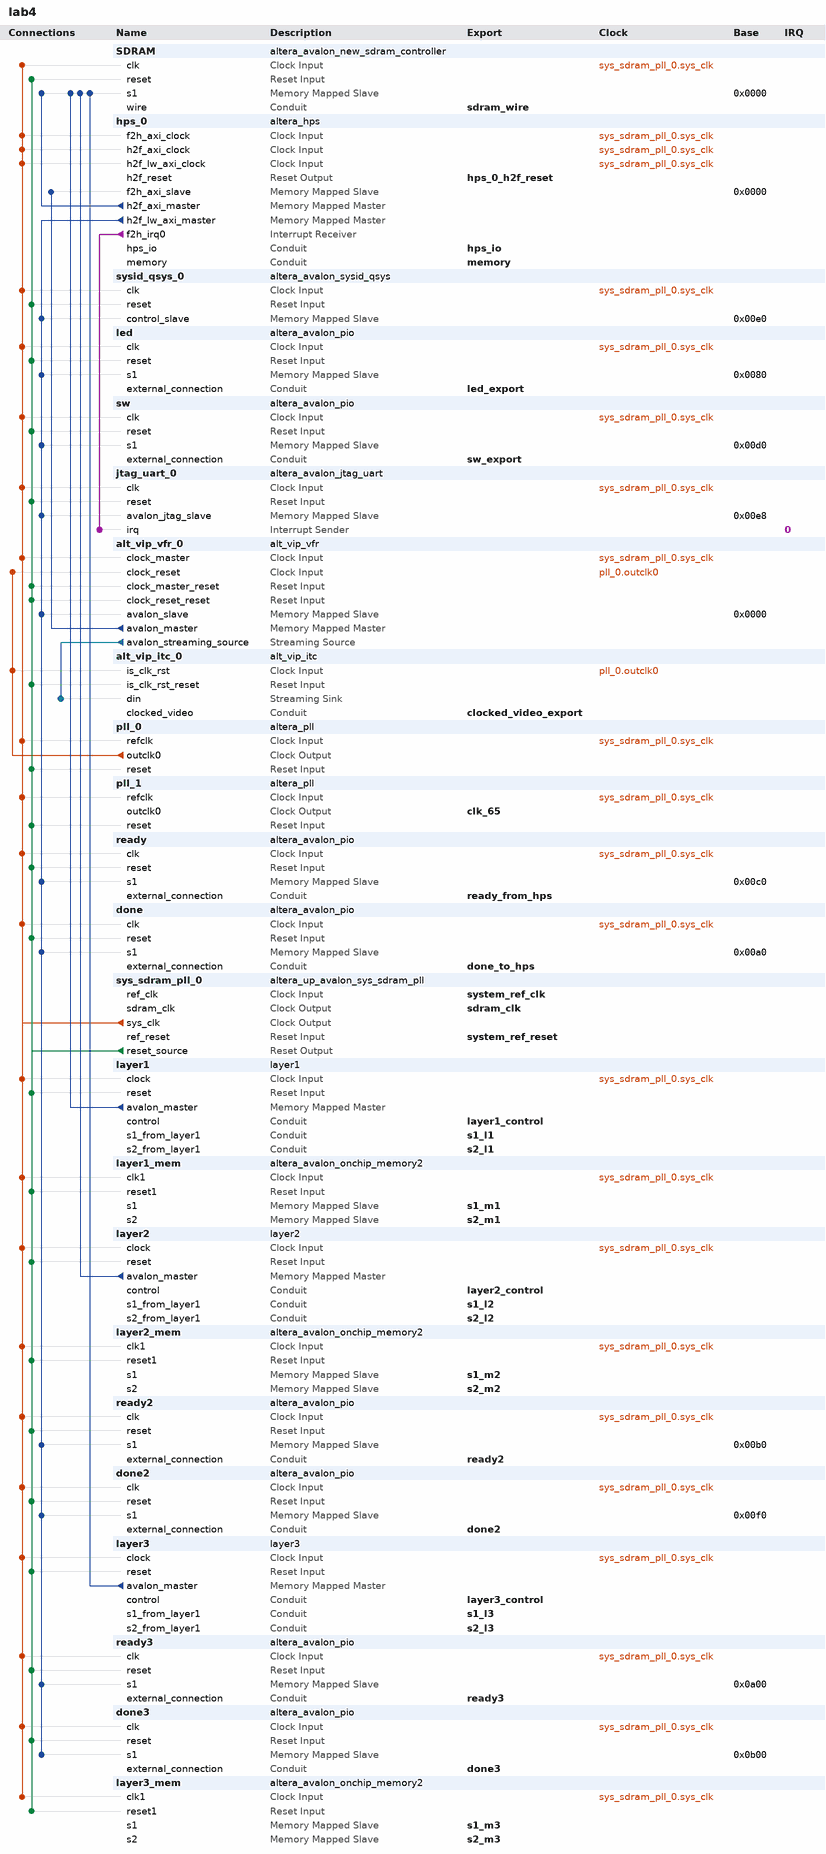
[diagram p0: system contents]
# Platform Designer (Qsys) system lab4, Cyclone V 5CSEMA5F31C6
# Parameters at their usual value, and those the tool derives, are not listed.
package require -exact qsys 15.0
create_system lab4
set_project_property DEVICE_FAMILY {Cyclone V}
set_project_property DEVICE 5CSEMA5F31C6

add_instance SDRAM altera_avalon_new_sdram_controller 15.0
set_instance_parameter_value SDRAM TAC 5.5
set_instance_parameter_value SDRAM TRCD 20.0
set_instance_parameter_value SDRAM TRP 20.0
set_instance_parameter_value SDRAM casLatency 3
set_instance_parameter_value SDRAM columnWidth 10
set_instance_parameter_value SDRAM dataWidth 16
set_instance_parameter_value SDRAM generateSimulationModel true
set_instance_parameter_value SDRAM model single_Micron_MT48LC4M32B2_7_chip
set_instance_parameter_value SDRAM numberOfBanks 4
set_instance_parameter_value SDRAM numberOfChipSelects 1
set_instance_parameter_value SDRAM powerUpDelay 100.0
set_instance_parameter_value SDRAM refreshPeriod 15.625
set_instance_parameter_value SDRAM rowWidth 13

add_instance hps_0 altera_hps 15.0
set_instance_parameter_value hps_0 BOOTFROMFPGA_Enable true
set_instance_parameter_value hps_0 EMAC1_Mode N/A
set_instance_parameter_value hps_0 EMAC1_PinMuxing Unused
set_instance_parameter_value hps_0 F2SCLK_COLDRST_Enable false
set_instance_parameter_value hps_0 F2SCLK_DBGRST_Enable false
set_instance_parameter_value hps_0 F2SCLK_WARMRST_Enable false
set_instance_parameter_value hps_0 F2SINTERRUPT_Enable true
set_instance_parameter_value hps_0 F2S_Width 3
set_instance_parameter_value hps_0 FPGA_PERIPHERAL_OUTPUT_CLOCK_FREQ_EMAC0_GTX_CLK 100
set_instance_parameter_value hps_0 FPGA_PERIPHERAL_OUTPUT_CLOCK_FREQ_EMAC0_MD_CLK 2.5
set_instance_parameter_value hps_0 FPGA_PERIPHERAL_OUTPUT_CLOCK_FREQ_EMAC1_GTX_CLK 100
set_instance_parameter_value hps_0 FPGA_PERIPHERAL_OUTPUT_CLOCK_FREQ_EMAC1_MD_CLK 2.5
set_instance_parameter_value hps_0 HPS_PROTOCOL DDR3
set_instance_parameter_value hps_0 I2C0_Mode N/A
set_instance_parameter_value hps_0 I2C0_PinMuxing Unused
set_instance_parameter_value hps_0 I2C1_Mode N/A
set_instance_parameter_value hps_0 I2C1_PinMuxing Unused
set_instance_parameter_value hps_0 LWH2F_Enable true
set_instance_parameter_value hps_0 MEM_BANKADDR_WIDTH 3
set_instance_parameter_value hps_0 MEM_CLK_FREQ 400.0
set_instance_parameter_value hps_0 MEM_COL_ADDR_WIDTH 10
set_instance_parameter_value hps_0 MEM_DQ_WIDTH 32
set_instance_parameter_value hps_0 MEM_DRV_STR RZQ/7
set_instance_parameter_value hps_0 MEM_ROW_ADDR_WIDTH 15
set_instance_parameter_value hps_0 MEM_RTT_NOM RZQ/4
set_instance_parameter_value hps_0 MEM_RTT_WR RZQ/4
set_instance_parameter_value hps_0 MEM_TCL 11
set_instance_parameter_value hps_0 MEM_TFAW_NS 30.0
set_instance_parameter_value hps_0 MEM_TRAS_NS 35.0
set_instance_parameter_value hps_0 MEM_TRCD_NS 13.75
set_instance_parameter_value hps_0 MEM_TRFC_NS 260.0
set_instance_parameter_value hps_0 MEM_TRP_NS 13.75
set_instance_parameter_value hps_0 MEM_VENDOR JEDEC
set_instance_parameter_value hps_0 MEM_WTCL 8
set_instance_parameter_value hps_0 QSPI_Mode N/A
set_instance_parameter_value hps_0 QSPI_PinMuxing Unused
set_instance_parameter_value hps_0 REF_CLK_FREQ 25.0
set_instance_parameter_value hps_0 S2F_Width 2
set_instance_parameter_value hps_0 SDIO_Mode {4-bit Data}
set_instance_parameter_value hps_0 SDIO_PinMuxing {HPS I/O Set 0}
set_instance_parameter_value hps_0 SPIM1_Mode N/A
set_instance_parameter_value hps_0 SPIM1_PinMuxing Unused
set_instance_parameter_value hps_0 STM_Enable false
set_instance_parameter_value hps_0 TIMING_BOARD_AC_SKEW 0.03
set_instance_parameter_value hps_0 TIMING_BOARD_AC_TO_CK_SKEW 0.0
set_instance_parameter_value hps_0 TIMING_BOARD_DQ_TO_DQS_SKEW 0.0
set_instance_parameter_value hps_0 TIMING_BOARD_MAX_CK_DELAY 0.03
set_instance_parameter_value hps_0 TIMING_BOARD_MAX_DQS_DELAY 0.02
set_instance_parameter_value hps_0 TIMING_BOARD_SKEW_BETWEEN_DQS 0.08
set_instance_parameter_value hps_0 TIMING_BOARD_SKEW_CKDQS_DIMM_MAX 0.16
set_instance_parameter_value hps_0 TIMING_BOARD_SKEW_CKDQS_DIMM_MIN 0.09
set_instance_parameter_value hps_0 TIMING_BOARD_SKEW_WITHIN_DQS 0.01
set_instance_parameter_value hps_0 TIMING_TDH 65
set_instance_parameter_value hps_0 TIMING_TDQSCK 255
set_instance_parameter_value hps_0 TIMING_TDQSQ 125
set_instance_parameter_value hps_0 TIMING_TDS 30
set_instance_parameter_value hps_0 TIMING_TIH 140
set_instance_parameter_value hps_0 TIMING_TIS 180
set_instance_parameter_value hps_0 TIMING_TQSH 0.4
set_instance_parameter_value hps_0 UART0_Mode {No Flow Control}
set_instance_parameter_value hps_0 UART0_PinMuxing {HPS I/O Set 0}
set_instance_parameter_value hps_0 USB1_Mode SDR
set_instance_parameter_value hps_0 USB1_PinMuxing {HPS I/O Set 0}
set_instance_parameter_value hps_0 desired_cfg_clk_mhz 100.0
set_instance_parameter_value hps_0 desired_qspi_clk_mhz 400.0

add_instance sysid_qsys_0 altera_avalon_sysid_qsys 15.0
set_instance_parameter_value sysid_qsys_0 id 0

add_instance led altera_avalon_pio 15.0
set_instance_parameter_value led bitModifyingOutReg true
set_instance_parameter_value led direction Output
set_instance_parameter_value led width 10

add_instance sw altera_avalon_pio 15.0
set_instance_parameter_value sw direction Input
set_instance_parameter_value sw simDoTestBenchWiring true
set_instance_parameter_value sw width 10

add_instance jtag_uart_0 altera_avalon_jtag_uart 15.0
set_instance_parameter_value jtag_uart_0 simInteractiveOptions NO_INTERACTIVE_WINDOWS

add_instance alt_vip_vfr_0 alt_vip_vfr 14.0
set_instance_parameter_value alt_vip_vfr_0 MAX_IMAGE_WIDTH 1024

add_instance alt_vip_itc_0 alt_vip_itc 14.0
set_instance_parameter_value alt_vip_itc_0 FIFO_DEPTH 1920
set_instance_parameter_value alt_vip_itc_0 H_ACTIVE_PIXELS 1024
set_instance_parameter_value alt_vip_itc_0 H_BACK_PORCH 160
set_instance_parameter_value alt_vip_itc_0 H_FRONT_PORCH 24
set_instance_parameter_value alt_vip_itc_0 H_SYNC_LENGTH 136
set_instance_parameter_value alt_vip_itc_0 NUMBER_OF_COLOUR_PLANES 4
set_instance_parameter_value alt_vip_itc_0 THRESHOLD 1919
set_instance_parameter_value alt_vip_itc_0 V_ACTIVE_LINES 768
set_instance_parameter_value alt_vip_itc_0 V_BACK_PORCH 29
set_instance_parameter_value alt_vip_itc_0 V_FRONT_PORCH 3
set_instance_parameter_value alt_vip_itc_0 V_SYNC_LENGTH 6

add_instance pll_0 altera_pll 15.0
set_instance_parameter_value pll_0 gui_device_speed_grade 2
set_instance_parameter_value pll_0 gui_number_of_clocks 1
set_instance_parameter_value pll_0 gui_operation_mode normal
set_instance_parameter_value pll_0 gui_output_clock_frequency0 130.0
set_instance_parameter_value pll_0 gui_pll_mode {Fractional-N PLL}
set_instance_parameter_value pll_0 gui_reference_clock_frequency 135.0
set_instance_parameter_value pll_0 gui_use_locked true

add_instance pll_1 altera_pll 15.0
set_instance_parameter_value pll_1 gui_device_speed_grade 2
set_instance_parameter_value pll_1 gui_number_of_clocks 1
set_instance_parameter_value pll_1 gui_operation_mode normal
set_instance_parameter_value pll_1 gui_output_clock_frequency0 65.0
set_instance_parameter_value pll_1 gui_pll_mode {Fractional-N PLL}
set_instance_parameter_value pll_1 gui_reference_clock_frequency 135.0
set_instance_parameter_value pll_1 gui_use_locked true

add_instance ready altera_avalon_pio 15.0
set_instance_parameter_value ready direction Output
set_instance_parameter_value ready width 1

add_instance done altera_avalon_pio 15.0
set_instance_parameter_value done direction Input
set_instance_parameter_value done simDoTestBenchWiring true
set_instance_parameter_value done width 7

add_instance sys_sdram_pll_0 altera_up_avalon_sys_sdram_pll 15.0
set_instance_parameter_value sys_sdram_pll_0 CV_boards DE1-SoC
set_instance_parameter_value sys_sdram_pll_0 gui_outclk 135.0
set_instance_parameter_value sys_sdram_pll_0 gui_refclk 50.0

add_instance layer1 layer1 1.0

add_instance layer1_mem altera_avalon_onchip_memory2 15.0
set_instance_parameter_value layer1_mem dataWidth 8
set_instance_parameter_value layer1_mem dualPort true
set_instance_parameter_value layer1_mem initMemContent true
set_instance_parameter_value layer1_mem initializationFileName /home/parnya94/Desktop/Part_III_HW/hex.hex
set_instance_parameter_value layer1_mem memorySize 72360
set_instance_parameter_value layer1_mem resetrequest_enabled false
set_instance_parameter_value layer1_mem singleClockOperation true

add_instance layer2 layer2 1.0

add_instance layer2_mem altera_avalon_onchip_memory2 15.0
set_instance_parameter_value layer2_mem dataWidth 8
set_instance_parameter_value layer2_mem dualPort true
set_instance_parameter_value layer2_mem initMemContent true
set_instance_parameter_value layer2_mem initializationFileName /home/parnya94/Desktop/Part_III_HW/hex.hex
set_instance_parameter_value layer2_mem memorySize 40200
set_instance_parameter_value layer2_mem resetrequest_enabled false
set_instance_parameter_value layer2_mem singleClockOperation true

add_instance ready2 altera_avalon_pio 15.0
set_instance_parameter_value ready2 direction Output
set_instance_parameter_value ready2 width 7

add_instance done2 altera_avalon_pio 15.0
set_instance_parameter_value done2 direction Input
set_instance_parameter_value done2 simDoTestBenchWiring true
set_instance_parameter_value done2 width 7

add_instance layer3 layer3 1.0

add_instance ready3 altera_avalon_pio 15.0
set_instance_parameter_value ready3 direction Output
set_instance_parameter_value ready3 width 7

add_instance done3 altera_avalon_pio 15.0
set_instance_parameter_value done3 direction Input
set_instance_parameter_value done3 simDoTestBenchWiring true
set_instance_parameter_value done3 width 1

add_instance layer3_mem altera_avalon_onchip_memory2 15.0
set_instance_parameter_value layer3_mem dataWidth 8
set_instance_parameter_value layer3_mem dualPort true
set_instance_parameter_value layer3_mem initMemContent true
set_instance_parameter_value layer3_mem initializationFileName /home/parnya94/Desktop/Part_III_HW/hex.hex
set_instance_parameter_value layer3_mem memorySize 2000
set_instance_parameter_value layer3_mem resetrequest_enabled false
set_instance_parameter_value layer3_mem singleClockOperation true

# connections
add_connection pll_0.outclk0 alt_vip_itc_0.is_clk_rst clock
add_connection pll_0.outclk0 alt_vip_vfr_0.clock_reset clock
add_connection sys_sdram_pll_0.sys_clk alt_vip_vfr_0.clock_master clock
add_connection sys_sdram_pll_0.sys_clk done2.clk clock
add_connection sys_sdram_pll_0.sys_clk done3.clk clock
add_connection sys_sdram_pll_0.sys_clk done.clk clock
add_connection sys_sdram_pll_0.sys_clk hps_0.f2h_axi_clock clock
add_connection sys_sdram_pll_0.sys_clk hps_0.h2f_axi_clock clock
add_connection sys_sdram_pll_0.sys_clk hps_0.h2f_lw_axi_clock clock
add_connection sys_sdram_pll_0.sys_clk jtag_uart_0.clk clock
add_connection sys_sdram_pll_0.sys_clk layer1.clock clock
add_connection sys_sdram_pll_0.sys_clk layer1_mem.clk1 clock
add_connection sys_sdram_pll_0.sys_clk layer2.clock clock
add_connection sys_sdram_pll_0.sys_clk layer2_mem.clk1 clock
add_connection sys_sdram_pll_0.sys_clk layer3.clock clock
add_connection sys_sdram_pll_0.sys_clk layer3_mem.clk1 clock
add_connection sys_sdram_pll_0.sys_clk led.clk clock
add_connection sys_sdram_pll_0.sys_clk pll_0.refclk clock
add_connection sys_sdram_pll_0.sys_clk pll_1.refclk clock
add_connection sys_sdram_pll_0.sys_clk ready2.clk clock
add_connection sys_sdram_pll_0.sys_clk ready3.clk clock
add_connection sys_sdram_pll_0.sys_clk ready.clk clock
add_connection sys_sdram_pll_0.sys_clk SDRAM.clk clock
add_connection sys_sdram_pll_0.sys_clk sw.clk clock
add_connection sys_sdram_pll_0.sys_clk sysid_qsys_0.clk clock
add_connection sys_sdram_pll_0.reset_source alt_vip_itc_0.is_clk_rst_reset reset
add_connection sys_sdram_pll_0.reset_source alt_vip_vfr_0.clock_master_reset reset
add_connection sys_sdram_pll_0.reset_source alt_vip_vfr_0.clock_reset_reset reset
add_connection sys_sdram_pll_0.reset_source done2.reset reset
add_connection sys_sdram_pll_0.reset_source done3.reset reset
add_connection sys_sdram_pll_0.reset_source done.reset reset
add_connection sys_sdram_pll_0.reset_source jtag_uart_0.reset reset
add_connection sys_sdram_pll_0.reset_source layer1.reset reset
add_connection sys_sdram_pll_0.reset_source layer1_mem.reset1 reset
add_connection sys_sdram_pll_0.reset_source layer2.reset reset
add_connection sys_sdram_pll_0.reset_source layer2_mem.reset1 reset
add_connection sys_sdram_pll_0.reset_source layer3.reset reset
add_connection sys_sdram_pll_0.reset_source layer3_mem.reset1 reset
add_connection sys_sdram_pll_0.reset_source led.reset reset
add_connection sys_sdram_pll_0.reset_source pll_0.reset reset
add_connection sys_sdram_pll_0.reset_source pll_1.reset reset
add_connection sys_sdram_pll_0.reset_source ready2.reset reset
add_connection sys_sdram_pll_0.reset_source ready3.reset reset
add_connection sys_sdram_pll_0.reset_source ready.reset reset
add_connection sys_sdram_pll_0.reset_source SDRAM.reset reset
add_connection sys_sdram_pll_0.reset_source sw.reset reset
add_connection sys_sdram_pll_0.reset_source sysid_qsys_0.reset reset
add_connection alt_vip_vfr_0.avalon_master hps_0.f2h_axi_slave avalon
set_connection_parameter_value alt_vip_vfr_0.avalon_master/hps_0.f2h_axi_slave baseAddress 0x0000
add_connection hps_0.h2f_axi_master SDRAM.s1 avalon
set_connection_parameter_value hps_0.h2f_axi_master/SDRAM.s1 baseAddress 0x0000
add_connection hps_0.h2f_lw_axi_master alt_vip_vfr_0.avalon_slave avalon
set_connection_parameter_value hps_0.h2f_lw_axi_master/alt_vip_vfr_0.avalon_slave baseAddress 0x0000
add_connection hps_0.h2f_lw_axi_master done2.s1 avalon
set_connection_parameter_value hps_0.h2f_lw_axi_master/done2.s1 baseAddress 0x00f0
add_connection hps_0.h2f_lw_axi_master done3.s1 avalon
set_connection_parameter_value hps_0.h2f_lw_axi_master/done3.s1 baseAddress 0x0b00
add_connection hps_0.h2f_lw_axi_master done.s1 avalon
set_connection_parameter_value hps_0.h2f_lw_axi_master/done.s1 baseAddress 0x00a0
add_connection hps_0.h2f_lw_axi_master jtag_uart_0.avalon_jtag_slave avalon
set_connection_parameter_value hps_0.h2f_lw_axi_master/jtag_uart_0.avalon_jtag_slave baseAddress 0x00e8
add_connection hps_0.h2f_lw_axi_master led.s1 avalon
set_connection_parameter_value hps_0.h2f_lw_axi_master/led.s1 baseAddress 0x0080
add_connection hps_0.h2f_lw_axi_master ready2.s1 avalon
set_connection_parameter_value hps_0.h2f_lw_axi_master/ready2.s1 baseAddress 0x00b0
add_connection hps_0.h2f_lw_axi_master ready3.s1 avalon
set_connection_parameter_value hps_0.h2f_lw_axi_master/ready3.s1 baseAddress 0x0a00
add_connection hps_0.h2f_lw_axi_master ready.s1 avalon
set_connection_parameter_value hps_0.h2f_lw_axi_master/ready.s1 baseAddress 0x00c0
add_connection hps_0.h2f_lw_axi_master sw.s1 avalon
set_connection_parameter_value hps_0.h2f_lw_axi_master/sw.s1 baseAddress 0x00d0
add_connection hps_0.h2f_lw_axi_master sysid_qsys_0.control_slave avalon
set_connection_parameter_value hps_0.h2f_lw_axi_master/sysid_qsys_0.control_slave baseAddress 0x00e0
add_connection layer1.avalon_master SDRAM.s1 avalon
set_connection_parameter_value layer1.avalon_master/SDRAM.s1 baseAddress 0x0000
add_connection layer2.avalon_master SDRAM.s1 avalon
set_connection_parameter_value layer2.avalon_master/SDRAM.s1 baseAddress 0x0000
add_connection layer3.avalon_master SDRAM.s1 avalon
set_connection_parameter_value layer3.avalon_master/SDRAM.s1 baseAddress 0x0000
add_connection alt_vip_vfr_0.avalon_streaming_source alt_vip_itc_0.din avalon_streaming
add_connection hps_0.f2h_irq0 jtag_uart_0.irq interrupt
set_connection_parameter_value hps_0.f2h_irq0/jtag_uart_0.irq irqNumber 0

# exported interfaces
add_interface clk_65 clock source
set_interface_property clk_65 EXPORT_OF pll_1.outclk0
add_interface clocked_video_export conduit end
set_interface_property clocked_video_export EXPORT_OF alt_vip_itc_0.clocked_video
add_interface done2 conduit end
set_interface_property done2 EXPORT_OF done2.external_connection
add_interface done3 conduit end
set_interface_property done3 EXPORT_OF done3.external_connection
add_interface done_to_hps conduit end
set_interface_property done_to_hps EXPORT_OF done.external_connection
add_interface hps_0_h2f_reset reset source
set_interface_property hps_0_h2f_reset EXPORT_OF hps_0.h2f_reset
add_interface hps_io conduit end
set_interface_property hps_io EXPORT_OF hps_0.hps_io
add_interface layer1_control conduit end
set_interface_property layer1_control EXPORT_OF layer1.control
add_interface layer2_control conduit end
set_interface_property layer2_control EXPORT_OF layer2.control
add_interface layer3_control conduit end
set_interface_property layer3_control EXPORT_OF layer3.control
add_interface led_export conduit end
set_interface_property led_export EXPORT_OF led.external_connection
add_interface memory conduit end
set_interface_property memory EXPORT_OF hps_0.memory
add_interface ready2 conduit end
set_interface_property ready2 EXPORT_OF ready2.external_connection
add_interface ready3 conduit end
set_interface_property ready3 EXPORT_OF ready3.external_connection
add_interface ready_from_hps conduit end
set_interface_property ready_from_hps EXPORT_OF ready.external_connection
add_interface s1_l1 conduit end
set_interface_property s1_l1 EXPORT_OF layer1.s1_from_layer1
add_interface s1_l2 conduit end
set_interface_property s1_l2 EXPORT_OF layer2.s1_from_layer1
add_interface s1_l3 conduit end
set_interface_property s1_l3 EXPORT_OF layer3.s1_from_layer1
add_interface s1_m1 avalon slave
set_interface_property s1_m1 EXPORT_OF layer1_mem.s1
add_interface s1_m2 avalon slave
set_interface_property s1_m2 EXPORT_OF layer2_mem.s1
add_interface s1_m3 avalon slave
set_interface_property s1_m3 EXPORT_OF layer3_mem.s1
add_interface s2_l1 conduit end
set_interface_property s2_l1 EXPORT_OF layer1.s2_from_layer1
add_interface s2_l2 conduit end
set_interface_property s2_l2 EXPORT_OF layer2.s2_from_layer1
add_interface s2_l3 conduit end
set_interface_property s2_l3 EXPORT_OF layer3.s2_from_layer1
add_interface s2_m1 avalon slave
set_interface_property s2_m1 EXPORT_OF layer1_mem.s2
add_interface s2_m2 avalon slave
set_interface_property s2_m2 EXPORT_OF layer2_mem.s2
add_interface s2_m3 avalon slave
set_interface_property s2_m3 EXPORT_OF layer3_mem.s2
add_interface sdram_clk clock source
set_interface_property sdram_clk EXPORT_OF sys_sdram_pll_0.sdram_clk
add_interface sdram_wire conduit end
set_interface_property sdram_wire EXPORT_OF SDRAM.wire
add_interface sw_export conduit end
set_interface_property sw_export EXPORT_OF sw.external_connection
add_interface system_ref_clk clock sink
set_interface_property system_ref_clk EXPORT_OF sys_sdram_pll_0.ref_clk
add_interface system_ref_reset reset sink
set_interface_property system_ref_reset EXPORT_OF sys_sdram_pll_0.ref_reset

set_interconnect_requirement {$system} qsys_mm.clockCrossingAdapter HANDSHAKE
set_interconnect_requirement {$system} qsys_mm.enableEccProtection FALSE
set_interconnect_requirement {$system} qsys_mm.insertDefaultSlave FALSE
set_interconnect_requirement {$system} qsys_mm.maxAdditionalLatency 1

save_system lab4.qsys
